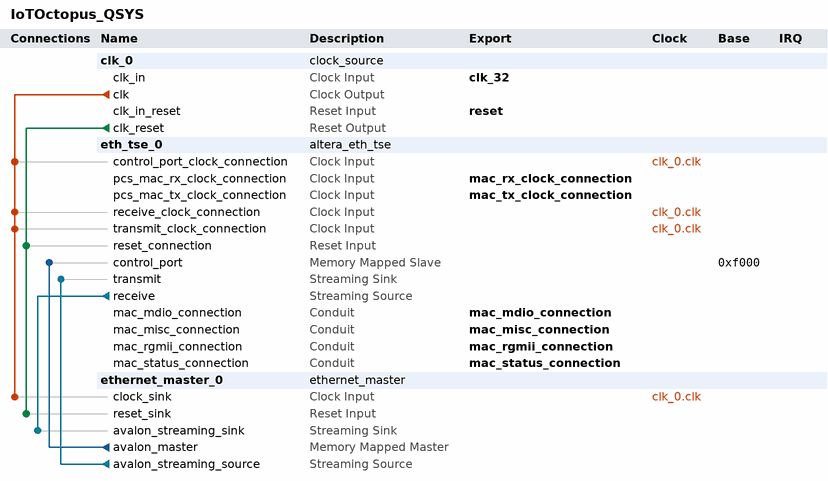
[diagram p0: system contents]
# Platform Designer (Qsys) system IoTOctopus_QSYS, Cyclone V 5CSEMA6F31C8
# Parameters at their usual value, and those the tool derives, are not listed.
package require -exact qsys 18.1
create_system IoTOctopus_QSYS
set_project_property DEVICE_FAMILY {Cyclone V}
set_project_property DEVICE 5CSEMA6F31C8

add_instance clk_0 clock_source 18.1
set_instance_parameter_value clk_0 clockFrequency 125000000

add_instance eth_tse_0 altera_eth_tse 18.1
set_instance_parameter_value eth_tse_0 XCVR_RCFG_JTAG_ENABLE 0
set_instance_parameter_value eth_tse_0 XCVR_SET_CAPABILITY_REG_ENABLE 0
set_instance_parameter_value eth_tse_0 XCVR_SET_CSR_SOFT_LOGIC_ENABLE 0
set_instance_parameter_value eth_tse_0 XCVR_SET_PRBS_SOFT_LOGIC_ENABLE 0
set_instance_parameter_value eth_tse_0 XCVR_SET_USER_IDENTIFIER 0
set_instance_parameter_value eth_tse_0 core_variation MAC_ONLY
set_instance_parameter_value eth_tse_0 enable_gmii_loopback true
set_instance_parameter_value eth_tse_0 enable_hd_logic true
set_instance_parameter_value eth_tse_0 enable_mac_flow_ctrl false
set_instance_parameter_value eth_tse_0 enable_magic_detect true
set_instance_parameter_value eth_tse_0 enable_shift16 true
set_instance_parameter_value eth_tse_0 ifGMII RGMII
set_instance_parameter_value eth_tse_0 ing_addr 11
set_instance_parameter_value eth_tse_0 mdio_clk_div 40
set_instance_parameter_value eth_tse_0 stat_cnt_ena false
set_instance_parameter_value eth_tse_0 transceiver_type NONE

add_instance ethernet_master_0 ethernet_master 1.0

# connections
add_connection clk_0.clk eth_tse_0.control_port_clock_connection clock
add_connection clk_0.clk eth_tse_0.receive_clock_connection clock
add_connection clk_0.clk eth_tse_0.transmit_clock_connection clock
add_connection clk_0.clk ethernet_master_0.clock_sink clock
add_connection clk_0.clk_reset eth_tse_0.reset_connection reset
add_connection clk_0.clk_reset ethernet_master_0.reset_sink reset
add_connection ethernet_master_0.avalon_master eth_tse_0.control_port avalon
set_connection_parameter_value ethernet_master_0.avalon_master/eth_tse_0.control_port baseAddress 0xf000
add_connection eth_tse_0.receive ethernet_master_0.avalon_streaming_sink avalon_streaming
add_connection ethernet_master_0.avalon_streaming_source eth_tse_0.transmit avalon_streaming

# exported interfaces
add_interface clk_32 clock sink
set_interface_property clk_32 EXPORT_OF clk_0.clk_in
add_interface mac_mdio_connection conduit end
set_interface_property mac_mdio_connection EXPORT_OF eth_tse_0.mac_mdio_connection
add_interface mac_misc_connection conduit end
set_interface_property mac_misc_connection EXPORT_OF eth_tse_0.mac_misc_connection
add_interface mac_rgmii_connection conduit end
set_interface_property mac_rgmii_connection EXPORT_OF eth_tse_0.mac_rgmii_connection
add_interface mac_rx_clock_connection clock sink
set_interface_property mac_rx_clock_connection EXPORT_OF eth_tse_0.pcs_mac_rx_clock_connection
add_interface mac_status_connection conduit end
set_interface_property mac_status_connection EXPORT_OF eth_tse_0.mac_status_connection
add_interface mac_tx_clock_connection clock sink
set_interface_property mac_tx_clock_connection EXPORT_OF eth_tse_0.pcs_mac_tx_clock_connection
add_interface reset reset sink
set_interface_property reset EXPORT_OF clk_0.clk_in_reset

set_interconnect_requirement {$system} qsys_mm.clockCrossingAdapter HANDSHAKE
set_interconnect_requirement {$system} qsys_mm.enableEccProtection FALSE
set_interconnect_requirement {$system} qsys_mm.insertDefaultSlave FALSE
set_interconnect_requirement {$system} qsys_mm.maxAdditionalLatency 1

save_system IoTOctopus_QSYS.qsys
